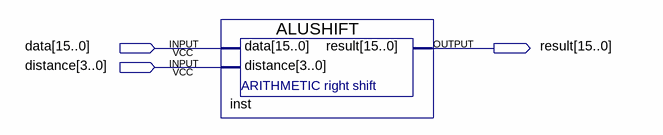
[diagram p0: schematic sheet]
// Quartus schematic lab403ALUSHIFT.bdf as structural Verilog: 1 symbols, 3 pins
module lab403ALUSHIFT (
  input  [15:0] data,
  input  [3:0] distance,
  output [15:0] result
);

  ALUSHIFT inst (.data(data), .distance(distance), .result(result));
endmodule
